# Altium schematic sheet Pico.SchDoc
size A4; SheetNumber: 4; SheetTotal: 6
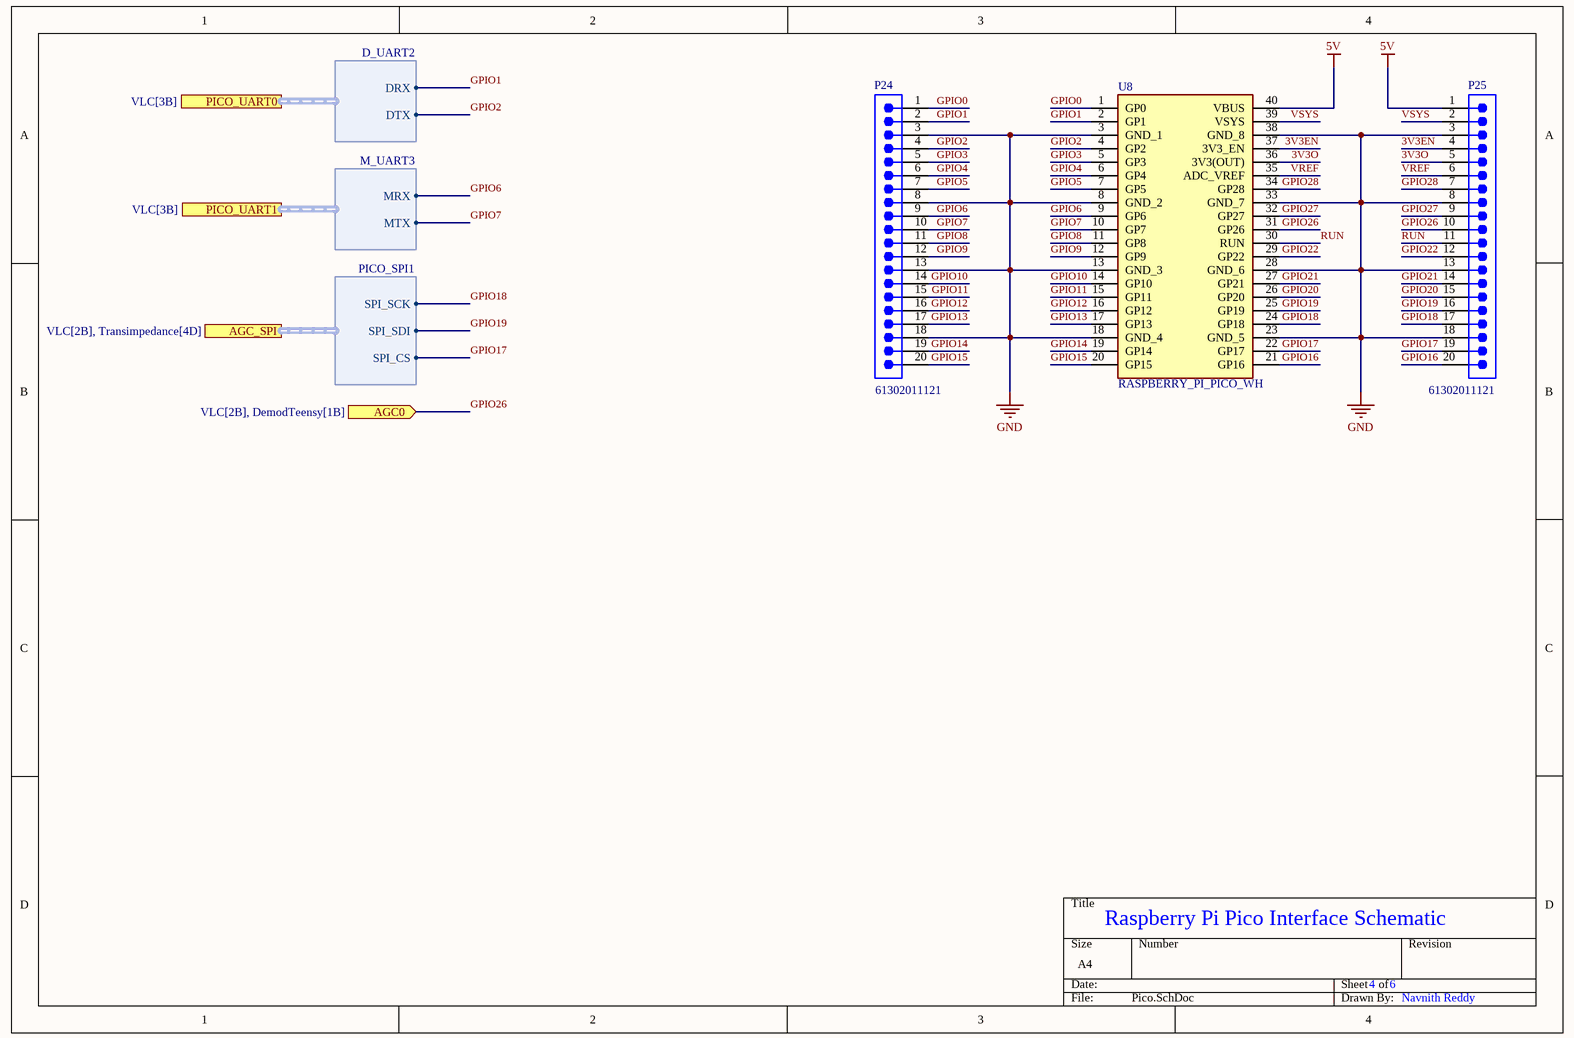
[diagram p0: Pico.SchDoc]

## Parts
P24  61302011121  [61302011121]
P25  61302011121  [61302011121]
U8  RASPBERRY_PI_PICO_WH  [RASPBERRYPIPICOWH]

## Ports
AGC0 (in, see VLC[2B], DemodTeensy[1B]), AGC_SPI (harness PICO_SPI1, see VLC[2B], Transimpedance[4D]), PICO_UART0 (harness D_UART2, see VLC[3B]), PICO_UART1 (harness M_UART3, see VLC[3B])

## Harnesses
PICO_SPI1: SPI_SCK, SPI_SDI, SPI_CS
M_UART3: MRX, MTX
D_UART2: DRX, DTX

## Nets
5V: P25.1 U8.40(VBUS)
GND: P24.3 P24.8 P24.13 P24.18 P25.3 P25.8 P25.13 P25.18 U8.3(GND_1) U8.8(GND_2) U8.13(GND_3) U8.18(GND_4) U8.23(GND_5) U8.28(GND_6) U8.33(GND_7) U8.38(GND_8)
3V3EN: P25.4 U8.37(3V3_EN)
3V3O: P25.5 U8.36(3V3(OUT))
GPIO0: P24.1 U8.1(GP0)
GPIO1: P24.2 U8.2(GP1) ; port PICO_UART0.DRX
GPIO2: P24.4 U8.4(GP2) ; port PICO_UART0.DTX
GPIO3: P24.5 U8.5(GP3)
GPIO4: P24.6 U8.6(GP4)
GPIO5: P24.7 U8.7(GP5)
GPIO6: P24.9 U8.9(GP6) ; port PICO_UART1.MRX
GPIO7: P24.10 U8.10(GP7) ; port PICO_UART1.MTX
GPIO8: P24.11 U8.11(GP8)
GPIO9: P24.12 U8.12(GP9)
GPIO10: P24.14 U8.14(GP10)
GPIO11: P24.15 U8.15(GP11)
GPIO12: P24.16 U8.16(GP12)
GPIO13: P24.17 U8.17(GP13)
GPIO14: P24.19 U8.19(GP14)
GPIO15: P24.20 U8.20(GP15)
GPIO16: P25.20 U8.21(GP16)
GPIO17: P25.19 U8.22(GP17) ; port AGC_SPI.SPI_CS
GPIO18: P25.17 U8.24(GP18) ; port AGC_SPI.SPI_SCK
GPIO19: P25.16 U8.25(GP19) ; port AGC_SPI.SPI_SDI
GPIO20: P25.15 U8.26(GP20)
GPIO21: P25.14 U8.27(GP21)
GPIO22: P25.12 U8.29(GP22)
GPIO26: P25.10 U8.31(GP26) ; port AGC0
GPIO27: P25.9 U8.32(GP27)
GPIO28: P25.7 U8.34(GP28)
RUN: P25.11 U8.30(RUN)
VREF: P25.6 U8.35(ADC_VREF)
VSYS: P25.2 U8.39(VSYS)

## Notes on the sheet
- Raspberry Pi Pico Interface Schematic
- 4
- 6
- Navnith Reddy

## Library data of the parts
P24 P25 = CMP-1502-01102-2: NexarPartId: 32855554; Number of Contacts: 20; Contact Resistance: 20mΩ; Pitch: 2.54mm; Gender: Male; Operating Supply Voltage: 250V; Connector Type: Male Pin; Current Rating: 3A; Packaging: Bulk; RoHS: Compliant; Contact Material: Copper; Contact Mating Length: 5.9944mm; Number of Positions: 20; Orientation: Vertical; Termination: Solder; Number of Pins: 20; Color: Black; REACH SVHC: Unknown; Mount: Through Hole; Contact Plating: Gold; Number of Rows: 1; Lead Pitch: 2.54mm
U8 = RASPBERRY_PI_PICO_WH: Undefined or Miscellaneous; Manufacturer_Name: RASPBERRY-PI; Manufacturer_Part_Number: RASPBERRY PI PICO WH; Datasheet Link: https://datasheets.raspberrypi.com/picow/pico-w-datasheet.pdf; Height: 4mm